# EasyEDA schematic Sheet_1.json
TITLE: Control PID Motor DC con Encoder; REV: 1.0; Date: 2021-10-22; Sheet: 1/1; Drawn By: Valdez Cruz Marco A.; Company: UPIITA-IPN
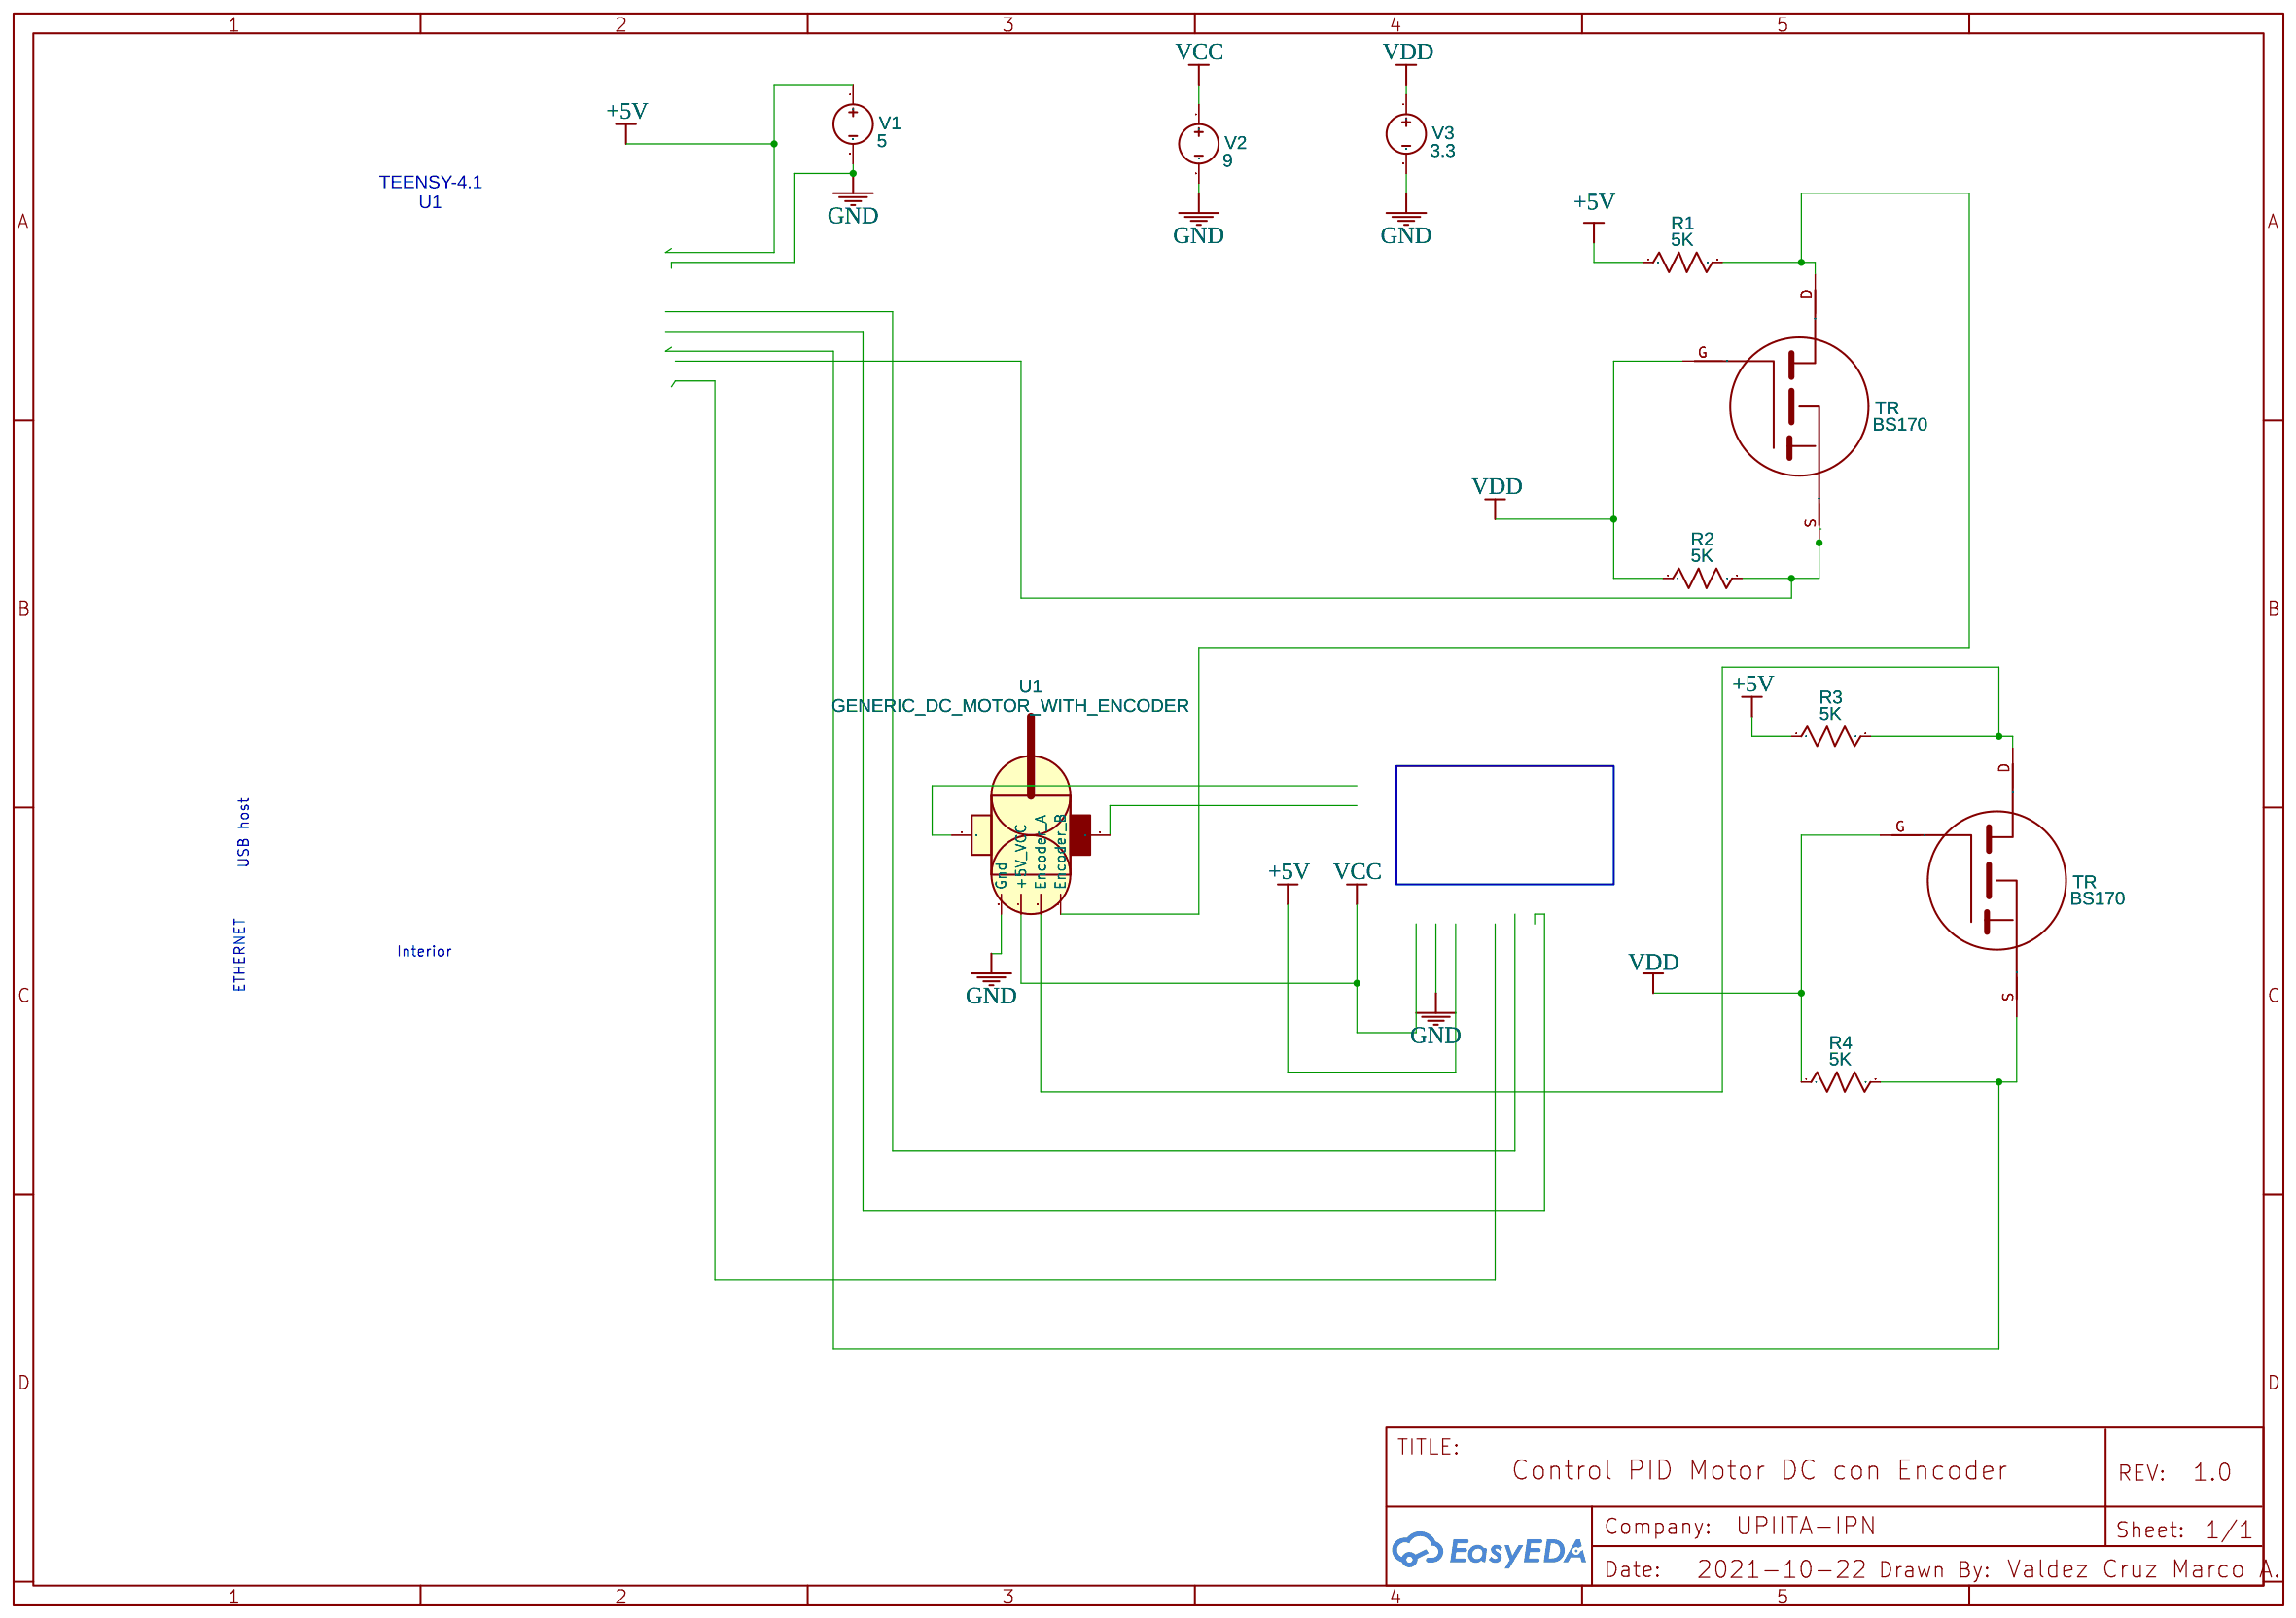
[diagram p0: schematic sheet]

## Parts
R1  5K  [AXIAL-0.3]
R2  5K  [AXIAL-0.3]
R3  5K  [AXIAL-0.3]
R4  5K  [AXIAL-0.3]
TR  BS170  [BS170]
TR#2  BS170  [BS170]
U1  GENERIC_DC_MOTOR_WITH_ENCODER  [?]
V1  5  [HDR1X2]
V2  9  [HDR1X2]
V3  3.3  [HDR1X2]

## Library data of the parts
R1-R4 = Resistor_US: Resistance: 1k; Contributor: EasyEDA; Supplier: YUJING
TR TR#2 = BS170: Contributor: lvtsh
U1 = GENERIC_DC_MOTOR_WITH_ENCODER: Contributor: Richard Delia; sourceId: iSM4m2WQ7; sim: true; Manufacturer Part: n/a; Supplier Part: n/a; Manufacturer: n/a; link: n/a
V1-V3 = VDC: Contributor: EasyEDA; sim: true

## Nets
+5V: R1.1 R3.1 V1.1
GND: U1.3(Gnd) V1.2 V2.2 V3.2
VCC: U1.4(+5V VCC) V2.1
VDD: R2.1 R4.1 TR.G TR#2.G V3.1
Net-(R1-2): R1.2 R3.2 TR.D TR#2.D U1.5(Encoder B)
Net-(R2-2): R2.2 TR.S
Net-(R4-2): R4.2 TR#2.S

Not connected (* = marked no-connect by the designer): U1 1(VP) 2(VN)

## Notes on the sheet
- TEENSY-4.1
- U1
- USB host
- Interior
- ETHERNET
